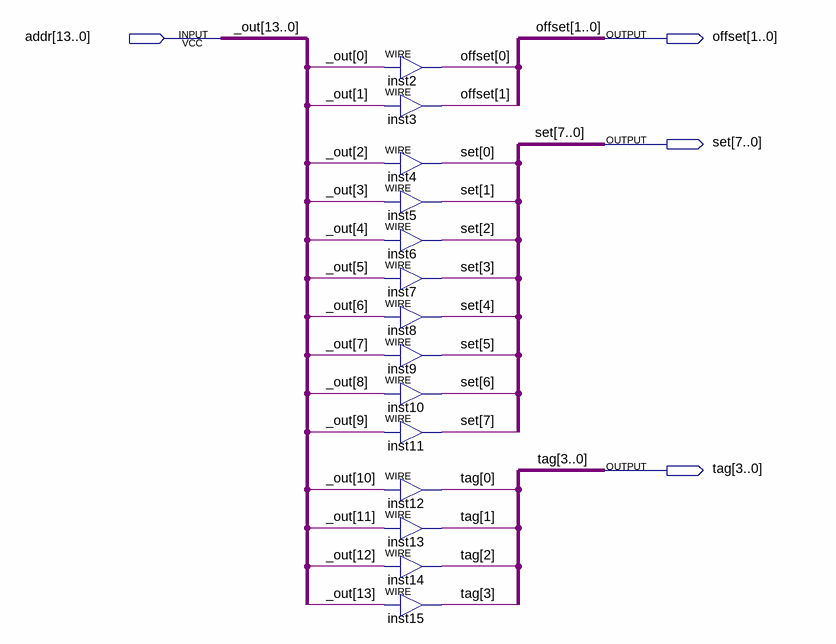
[diagram p0: schematic sheet]
// Quartus schematic cache_addr_parse.bdf as structural Verilog: 14 symbols, 4 pins
module cache_addr_parse (
  input  [13:0] addr,
  output [1:0] offset,
  output [7:0] set,
  output [3:0] tag
);

  assign offset[0] = addr[0];  // WIRE inst2
  assign offset[1] = addr[1];  // WIRE inst3
  assign set[0] = addr[2];  // WIRE inst4
  assign set[1] = addr[3];  // WIRE inst5
  assign set[2] = addr[4];  // WIRE inst6
  assign set[3] = addr[5];  // WIRE inst7
  assign set[4] = addr[6];  // WIRE inst8
  assign set[5] = addr[7];  // WIRE inst9
  assign set[6] = addr[8];  // WIRE inst10
  assign set[7] = addr[9];  // WIRE inst11
  assign tag[0] = addr[10];  // WIRE inst12
  assign tag[1] = addr[11];  // WIRE inst13
  assign tag[2] = addr[12];  // WIRE inst14
  assign tag[3] = addr[13];  // WIRE inst15

  // Other names for the same wires on the sheet: _out[13:0] = addr
endmodule
